# Altium schematic sheet JacdacEc30TemplateRnd20x20+1+0 107.SchDoc: Complete design
size A4; DocumentNumber: 1; SheetNumber: 1; SheetTotal: 1; VersionControl_RevNumber: 1
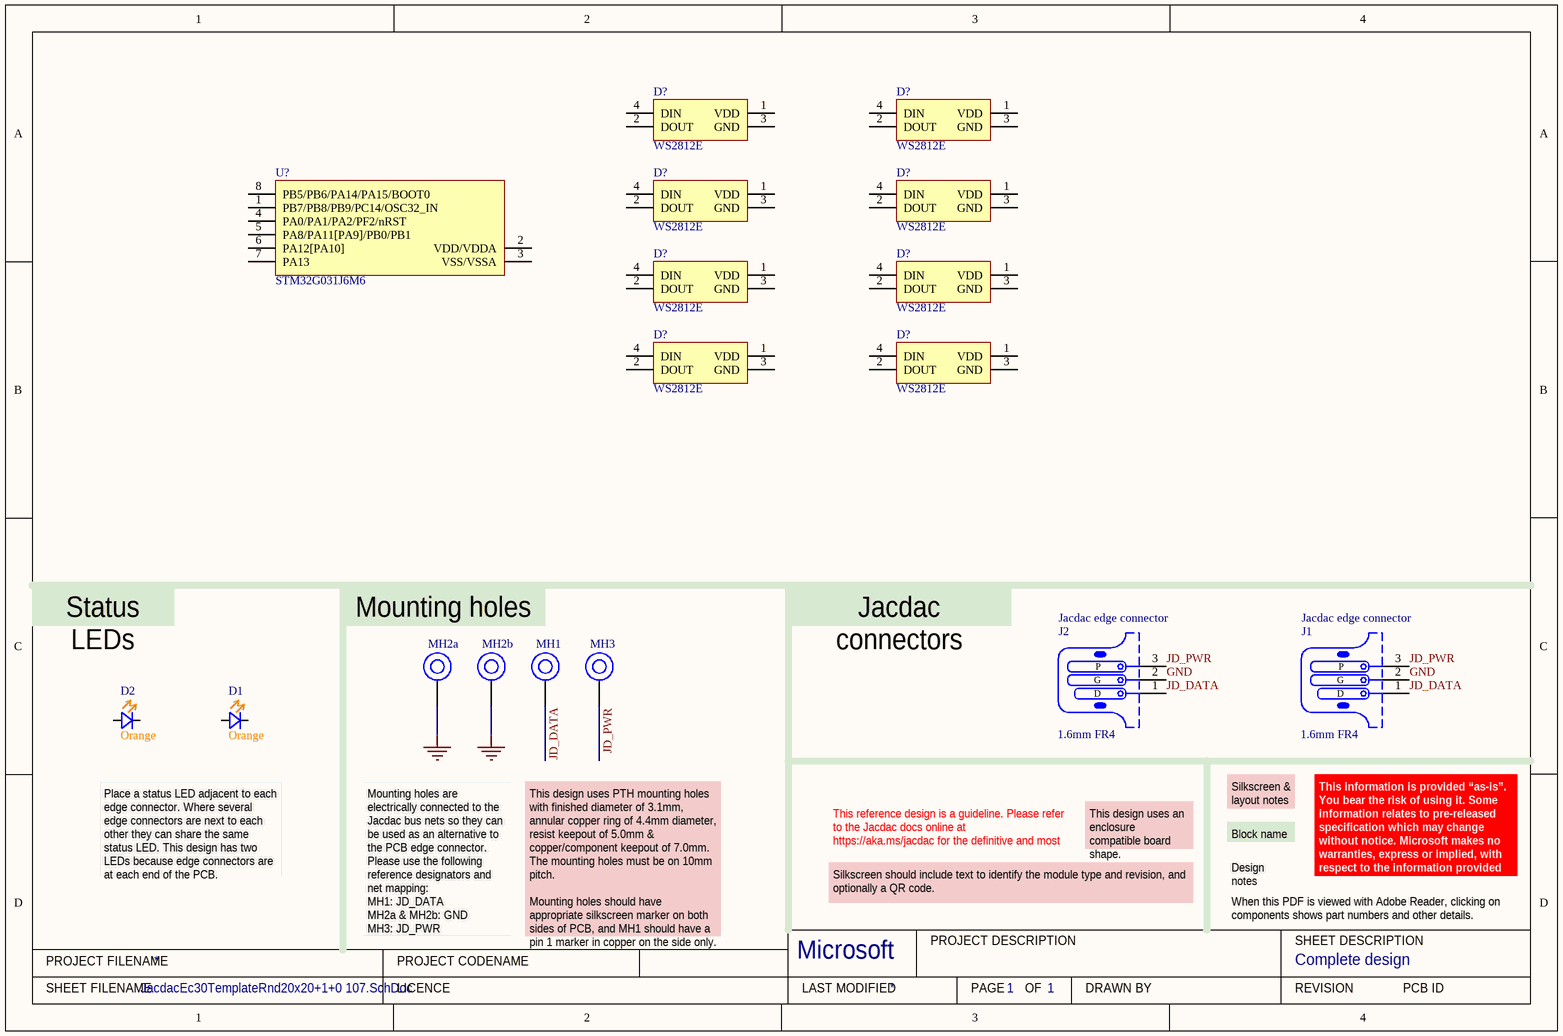
[diagram p0: JacdacEc30TemplateRnd20x20+1+0 107.SchDoc]

## Parts
(Parts that share a designator on the sheet are numbered #1, #2 ... from top to bottom, then left to right.)
D1  Colour: Orange  [0603 Orange]  (hidden comment: 19-217/S2C-AQ1R1B/3T)
D2  Colour: Orange  [0603 Orange]  (hidden comment: 19-217/S2C-AQ1R1B/3T)
D?#1  WS2812E  [WS2812E-5050]
D?#2  WS2812E  [WS2812E-5050]
D?#3  WS2812E  [WS2812E-5050]
D?#4  WS2812E  [WS2812E-5050]
D?#5  WS2812E  [WS2812E-5050]
D?#6  WS2812E  [WS2812E-5050]
D?#7  WS2812E  [WS2812E-5050]
D?#8  WS2812E  [WS2812E-5050]
J1  Jacdac edge connector  PCB Type: 1.6mm FR4  [JACDAC_EDGE_CONNECTOR_NO_TRACES_V2DIMS]  (no BOM)
J2  Jacdac edge connector  PCB Type: 1.6mm FR4  [JACDAC_EDGE_CONNECTOR_NO_TRACES_V2DIMS]  (no BOM)
MH1  MH_6.5MMK_4.5MMC_3.0MMD_PTH  [MH_6.5MMK_4.5MMC_3.0MMD_PTH]  (value not drawn)  (no BOM)
MH2a  MH_6.5MMK_4.5MMC_3.0MMD_PTH  [MH_6.5MMK_4.5MMC_3.0MMD_PTH]  (value not drawn)  (no BOM)
MH2b  MH_6.5MMK_4.5MMC_3.0MMD_PTH  [MH_6.5MMK_4.5MMC_3.0MMD_PTH]  (value not drawn)  (no BOM)
MH3  MH_6.5MMK_4.5MMC_3.0MMD_PTH  [MH_6.5MMK_4.5MMC_3.0MMD_PTH]  (value not drawn)  (no BOM)
U?  STM32G031J6M6  [8-SOIC]

## Nets
GND: J1.2(G) J2.2(G) MH2a.1 MH2b.1
JD_DATA: J1.1(D) J2.1(D) MH1.1
JD_PWR: J1.3(P) J2.3(P) MH3.1

Not connected (* = marked no-connect by the designer): D1 1(K) 2(A); D2 1(K) 2(A); D?#1 1(VDD) 2(DOUT) 3(GND) 4(DIN); D?#2 1(VDD) 2(DOUT) 3(GND) 4(DIN); D?#3 1(VDD) 2(DOUT) 3(GND) 4(DIN); D?#4 1(VDD) 2(DOUT) 3(GND) 4(DIN); D?#5 1(VDD) 2(DOUT) 3(GND) 4(DIN); D?#6 1(VDD) 2(DOUT) 3(GND) 4(DIN); D?#7 1(VDD) 2(DOUT) 3(GND) 4(DIN); D?#8 1(VDD) 2(DOUT) 3(GND) 4(DIN); U? 1(PB7/PB8/PB9/PC14/OSC32_IN) 2(VDD/VDDA) 3(VSS/VSSA) 4(PA0/PA1/PA2/PF2/nRST) 5(PA8/PA11[PA9]/PB0/PB1) 6(PA12[PA10]) 7(PA13) 8(PB5/PB6/PA14/PA15/BOOT0)

## Notes on the sheet
- Status LEDs
- Mounting holes
- Jacdac connectors
- This reference design is a guideline. Please refer to the Jacdac docs online at https://aka.ms/jacdac for the definitive and most up-to-date information.
- This design uses an enclosure compatible board shape.
- Block name
- Silkscreen & layout notes
- Place a status LED adjacent to each edge connector. Where several edge connectors are next to each other they can share the same status LED. This design has two LEDs because edge connectors are at each end of the PCB.
- Mounting holes are electrically connected to the Jacdac bus nets so they can be used as an alternative to the PCB edge connector. Please use the following reference designators and net mapping:
- Silkscreen should include text to identify the module type and revision, and optionally a QR code.
- Design notes
- When this PDF is viewed with Adobe Reader, clicking on components shows part numbers and other details.
- This information is provided “as-is”. You bear the risk of using it. Some information relates to pre-released specification which may change without notice. Microsoft makes no warranties, express or implied, with respect to the information provided here.
- MH1: JD_DATA
  MH2a & MH2b: GND
  MH3: JD_PWR
- This design uses PTH mounting holes with finished diameter of 3.1mm, annular copper ring of 4.4mm diameter, resist keepout of 5.0mm & copper/component keepout of 7.0mm. The mounting holes must be on 10mm pitch.
  Mounting holes should have appropriate silkscreen marker on both sides of PCB, and MH1 should have a pin 1 marker in copper on the side only.
- PROJECT FILENAME
- PROJECT CODENAME
- Microsoft
- PROJECT DESCRIPTION
- SHEET DESCRIPTION
- SHEET FILENAME
- LICENCE
- LAST MODIFIED
- PAGE
- OF
- DRAWN BY
- REVISION
- PCB ID

## Library data of the parts
D1 D2 = 19-217/S2C-AQ1R1B/3T: LED ORANGE DIFFUSED 0603 SMD; Manufacturer: Everlight Elec; Manufacturer Part Number: 19-217/S2C-AQ1R1B/3T; Mount: Surface Mount; Case/Package: 0603; Color: Orange; Case Code (Imperial): 0603; ComponentLink1URL: https://datasheet.lcsc.com/lcsc/1912171731_Everlight-Elec-19-217-S2C-AQ1R1B-3T_C146215.pdf; ComponentLink1Description: Online datasheet; Supplier 1: LCSC; Supplier 1 Part Number: C146215
D?#1-D?#8 = WS2812E-5050: WS2812E 5050 RGB LED WITH INTEGRATED DRIVER; Manufacturer: Worldsemi; Color: Blue,Green,Red; Supplier 1 Part Number 3: C139127; RoHS: Yes; Category: LEDs; Mount: Surface Mount; Length: 5mm; Width: 5mm; ComponentLink1URL: https://datasheet.lcsc.com/lcsc/1811151230_Worldsemi-WS2812E_C139127.pdf; ComponentLink1Description: Online datasheet; Supplier 1: LCSC; Manufacturer Part Number: WS2812E
J1 J2 = Jacdac edge connector: 3 pin Jacdac edge connector 1.27mm pitch; Manufacturer Part Number: JACDAC_EDGE_CONNECTOR; Checked By: ?; Created By: D. Gakure; ComponentLink1Description: Yuliang JACDAC cable connector drawing online; ComponentLink1URL: https://github.com/microsoft/jacdac-mdk/blob/main/connector/JACDAC-Connector-by-Yuliang-2020-11-28.pdf; ComponentLink2Description: JACDAC PCB edge connector spec onlin; ComponentLink2URL: https://github.com/microsoft/jacdac-mdk/blob/main/connector/JACDAC_PCB_Edge_Connector_Drawing_JD-PEC-01_rev_01.pdf
MH1 MH2a MH2b MH3 = MH_6.5MMK_4.5MMC_3.0MMD_PTH: Mounting Hole 6.5mm keepout, 4.5mm annualar ring and 3.0mm Drill PTH
U? = STM32G031J6M6: MCU 32-bit ARM Cortex M0+ RISC 32KB Flash 2.5V/3.3V 8-Pin SO N Tube; Manufacturer: STMicroelectronics; Supplier 1: Digi-Key; RoHS: Yes; Category: Microcontrollers; Pricing 1: 1=1.80000, 10=1.61600, 25=1.52480, 100=1.29920, 250=1.21992, 500=1.06744, 1000=0.88952 (USD); Supplier 2: Future Electronics; Pricing 2: 1=1.91000, 25=1.70000, 75=1.63000, 150=1.59000, 400=1.53000 (USD); Supplier 3: Mouser; Pricing 3: 1=1.50000, 10=1.28000, 50=1.28000, 100=1.09000, 1000=0.73700, 10000=0.71100 (USD); Supplier Part Number 3: 511-STM32G031J6M6; Supplier Part Number 2: 2116576; Supplier Part Number 1: 497-19552-ND; Created By: D. Gakure; Checked By: ?; ComponentLink1Description: Online datasheet; ComponentLink1URL: https://www.st.com/resource/en/datasheet/stm32g031c6.pdf; Manufacturer Part Number: STM32G031J6M6